# EAGLE design TinySmps (EAGLE 7.5.0)
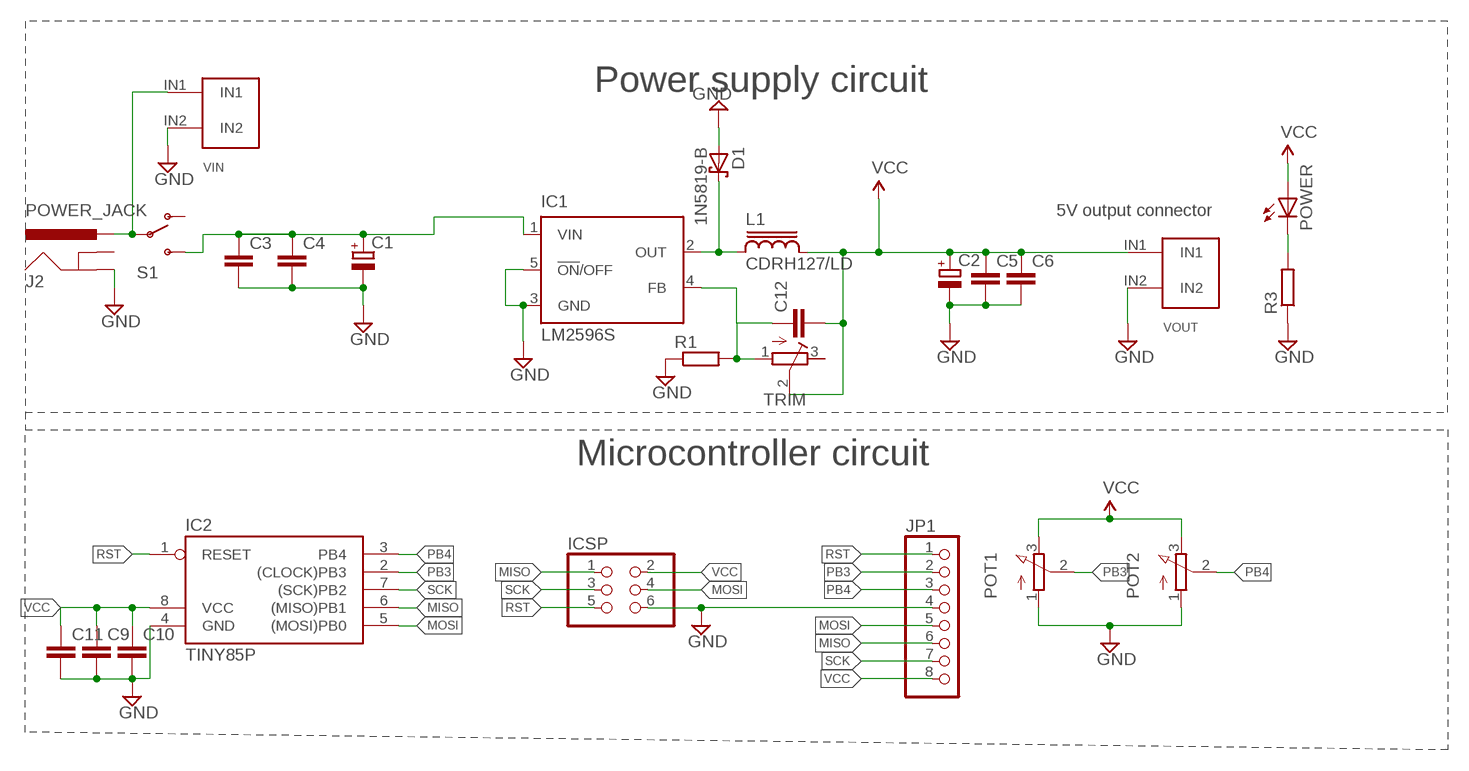
[diagram p0: schematic, sheet 1]

## Parts
C1  CPOL-EUE7.5-16  [E7,5-16]
C2  CPOL-EUE5-10.5  [E5-10,5]
C3  C-EUC1206  [C1206]
C4  C-EUC1206  [C1206]
C5  C-EUC1206  [C1206]
C6  C-EUC1206  [C1206]
C9  C-EUC1206  [C1206]
C10  C-EUC1206  [C1206]
C11  C-EUC1206  [C1206]
C12  C2,5-3  [C2.5-3]
D1  1N5819-B  [DO41-7.6]
IC1  LM2596S  [TO263-5]
IC2  TINY85P  TINY22P  [DIL08]
ICSP  PINHD-2X3  [2X03]
J2  POWER_JACK  [POWER_JACK_PTH]
JP1  PINHD-1X8  [1X08]
L1  CDRH127/LD  [CDRH127/LD]
POT1  3RP/1610N  [3RP/1610N]
POT2  3RP/1610N  [3RP/1610N]
POWER  LEDSML0805  [SML0805]
R1  R-EU_0204/7  [0204/7]
R3  R-EU_R1206  [R1206]
S1  SWITCH-SPDTKIT  [SWITCH-SPDT_KIT]
TRIM  R-TRIMM3296W  [RTRIM3296W]
VIN  1X2_5MM  [1X2_5MM]
VOUT  1X2_5MM  [1X2_5MM]

## Nets
GND: C1.- C2.- C3.2 C4.2 C5.2 C6.2 C9.2 C10.2 C11.2 D1.A IC1.3(GND) IC1.5(!ON!/OFF) IC2.4(GND) ICSP.6 J2.GND JP1.4 POT1.1(A) POT2.1(A) R1.1 R3.1 VIN.IN2 VOUT.IN2
IN: C1.+ C3.1 C4.1 IC1.1(VIN) S1.3(S)
MISO: IC2.6((MISO)PB1) ICSP.1 JP1.6
MOSI: IC2.5((MOSI)PB0) ICSP.4 JP1.5
N$1: POWER.C R3.2
N$2: D1.C IC1.2(OUT) L1.1
N$3: C12.1 IC1.4(FB) R1.2 TRIM.1(A)
N$4: J2.PWR S1.2(P) VIN.IN1
PB3: IC2.2((CLOCK)PB3) JP1.2 POT1.2(S)
PB4: IC2.3(PB4) JP1.3 POT2.2(S)
RST: IC2.1(RESET) ICSP.5 JP1.1
SCK: IC2.7((SCK)PB2) ICSP.3 JP1.7
VCC: C2.+ C5.1 C6.1 C9.1 C10.1 C11.1 C12.2 IC2.8(VCC) ICSP.2 JP1.8 L1.2 POT1.3(E) POT2.3(E) POWER.A TRIM.2(S) VOUT.IN1
Unconnected: J2.GNDBREAK S1.1(O) TRIM.3(E)

## Notes on the sheet
- Power supply circuit
- 5V output connector
- Microcontroller circuit

## Library data of the parts
C1 C2 = resistor:CPOL-EU: POLARIZED CAPACITOR, European symbol
C3-C6 C9-C11 = rcl:C-EU: CAPACITOR, European symbol
C12 = capacitor-wima:C: CAPACITOR naming: grid - package width
D1 = diode:1N581*: 1.0A SCHOTTKY BARRIER RECTIFIER Source: http://www.diodes.com/datasheets/ds23001.pdf
IC1 = national-semiconductor:LM2596: SIMPLE SWITCHER® Power Converter 150 kHz 3A Step-Down Voltage Regulator Source: http://www.national.com/ds/LM/LM2596.pdf; MF: NATIONAL SEMICONDUCTOR; MPN: LM2596S-ADJ/NOPB; OC_FARNELL: 9494367; OC_NEWARK: 41K3842
IC2 = atmel:TINY22: MICROCONTROLLER 1K ROM 128 bytes RAM 128 bytes EEPROM; OC_FARNELL: unknown; OC_NEWARK: unknown
ICSP = pinhead:PINHD-2X3: PIN HEADER
J2 = SparkFun-Connectors:POWER_JACK: Power Jack Connector This is the standard 5.5mm barrel jack for power. The PTH is the most common, proven, reliable, footprint. The Slot footprint only works if the mill layer is transmitted to the PCB fab house so be warned. Here are the connectors we sell at SparkFun: DC Barrel Power Jack/Connector <https://www.sparkfun.com/products/119> (PRT-00119) DC Barrel Power Jack/Connector (SMD) <https://www.sparkfun.com/products/12748> (PRT-12748) DC Barrel Jack Adapter - Breadboard Compatible <https://www.sparkfun.com/products/10811> (PRT-10811) It is used on this SparkFun product (and many, many others): SparkFun RedBoard - Programmed with Arduino <https://www.sparkfun.com/products/12757> (DEV-12757) Also, if you need a mating power supply or connector, please check these out: Wall Adapter Power Supply - 9VDC 650mA <https://www.sparkfun.com/products/298> (TOL-00298) DC Barrel Jack Adapter - Male <https://www.sparkfun.com/products/10287> (PRT-10287); PROD_ID: CONN-08197
JP1 = pinhead:PINHD-1X8: PIN HEADER
L1 = inductor-sumida:CDRH127/LD: Power Inductor
POT1 POT2 = pot:3RP/1610N: 16mm Potentiometer one level Source: http://www.alphapotentiometers.net/html/16mm_pot_2.html
POWER = led:LED: LED OSRAM: - CHIPLED LG R971, LG N971, LY N971, LG Q971, LY Q971, LO R971, LY R971 LH N974, LH R974 LS Q976, LO Q976, LY Q976 LO Q996 - Hyper CHIPLED LW Q18S LB Q993, LB Q99A, LB R99A - SideLED LS A670, LO A670, LY A670, LG A670, LP A670 LB A673, LV A673, LT A673, LW A673 LH A674 LY A675 LS A676, LA A676, LO A676, LY A676, LW A676 LS A679, LY A679, LG A679 - Hyper Micro SIDELED® LS Y876, LA Y876, LO Y876, LY Y876 LT Y87S - SmartLED LW L88C, LW L88S LB L89C, LB L89S, LG L890 LS L89K, LO L89K, LY L89K LS L896, LA L896, LO L896, LY L896 - TOPLED LS T670, LO T670, LY T670, LG T670, LP T670 LSG T670, LSP T670, LSY T670, LOP T670, LYG T670 LG T671, LOG T671, LSG T671 LB T673, LV T673, LT T673, LW T673 LH T674 LS T676, LA T676, LO T676, LY T676, LB T676, LH T676, LSB T676, LW T676 LB T67C, LV T67C, LT T67C, LS T67K, LO T67K, LY T67K, LW E67C LS E67B, LA E67B, LO E67B, LY E67B, LB E67C, LV E67C, LT E67C LW T67C LS T679, LY T679, LG T679 LS T770, LO T770, LY T770, LG T770, LP T770 LB T773, LV T773, LT T773, LW T773 LH T774 LS E675, LA E675, LY E675, LS T675 LS T776, LA T776, LO T776, LY T776, LB T776 LHGB T686 LT T68C, LB T68C - Hyper Mini TOPLED® LB M676 - Mini TOPLED Santana® LG M470 LS M47K, LO M47K, LY M47K Source: http://www.osram.convergy.de LUXEON: - LUMILED® LXK2-PW12-R00, LXK2-PW12-S00, LXK2-PW14-U00, LXK2-PW14-V00 LXK2-PM12-R00, LXK2-PM12-S00, LXK2-PM14-U00 LXK2-PE12-Q00, LXK2-PE12-R00, LXK2-PE12-S00, LXK2-PE14-T00, LXK2-PE14-U00 LXK2-PB12-K00, LXK2-PB12-L00, LXK2-PB12-M00, LXK2-PB14-N00, LXK2-PB14-P00, LXK2-PB14-Q00 LXK2-PR12-L00, LXK2-PR12-M00, LXK2-PR14-Q00, LXK2-PR14-R00 LXK2-PD12-Q00, LXK2-PD12-R00, LXK2-PD12-S00 LXK2-PH12-R00, LXK2-PH12-S00 LXK2-PL12-P00, LXK2-PL12-Q00, LXK2-PL12-R00 Source: www.luxeon.com KINGBRIGHT: KA-3528ASYC Source: www.kingbright.com
R1 = rcl:R-EU_: RESISTOR, European symbol
R3 = resistor:R-EU_: RESISTOR, European symbol
S1 = SparkFun-Electromechanical:SWITCH-SPDT: SPDT Switch Simple slide switch, Spark Fun Electronics SKU : COM-00102 DPDT SMT slide switch, AYZ0202, SWCH-08179; PROD_ID: SWCH-08261
TRIM = resistor:R-TRIMM: Trimm resistor
VIN VOUT = doru_terminal_block:1X2_5MM

## Board
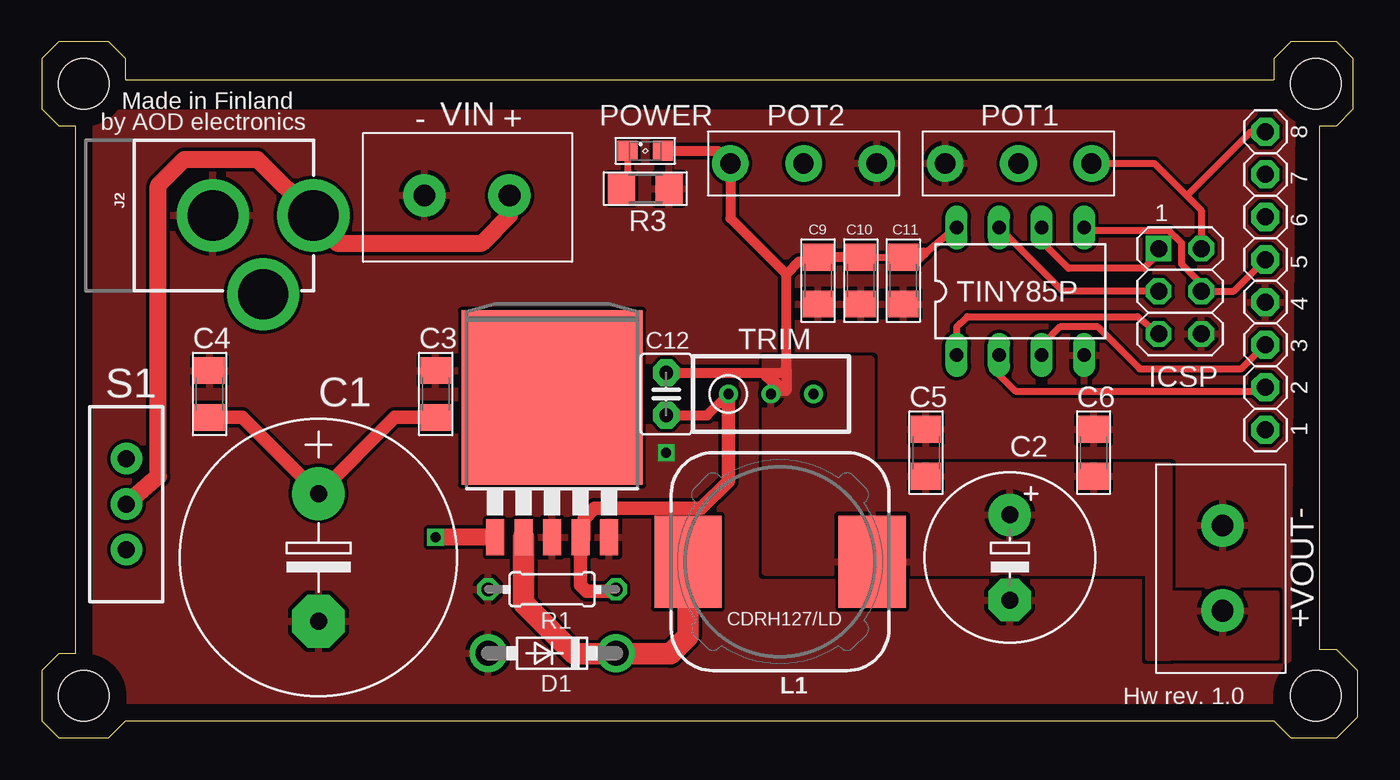
[diagram p1: board, top side]
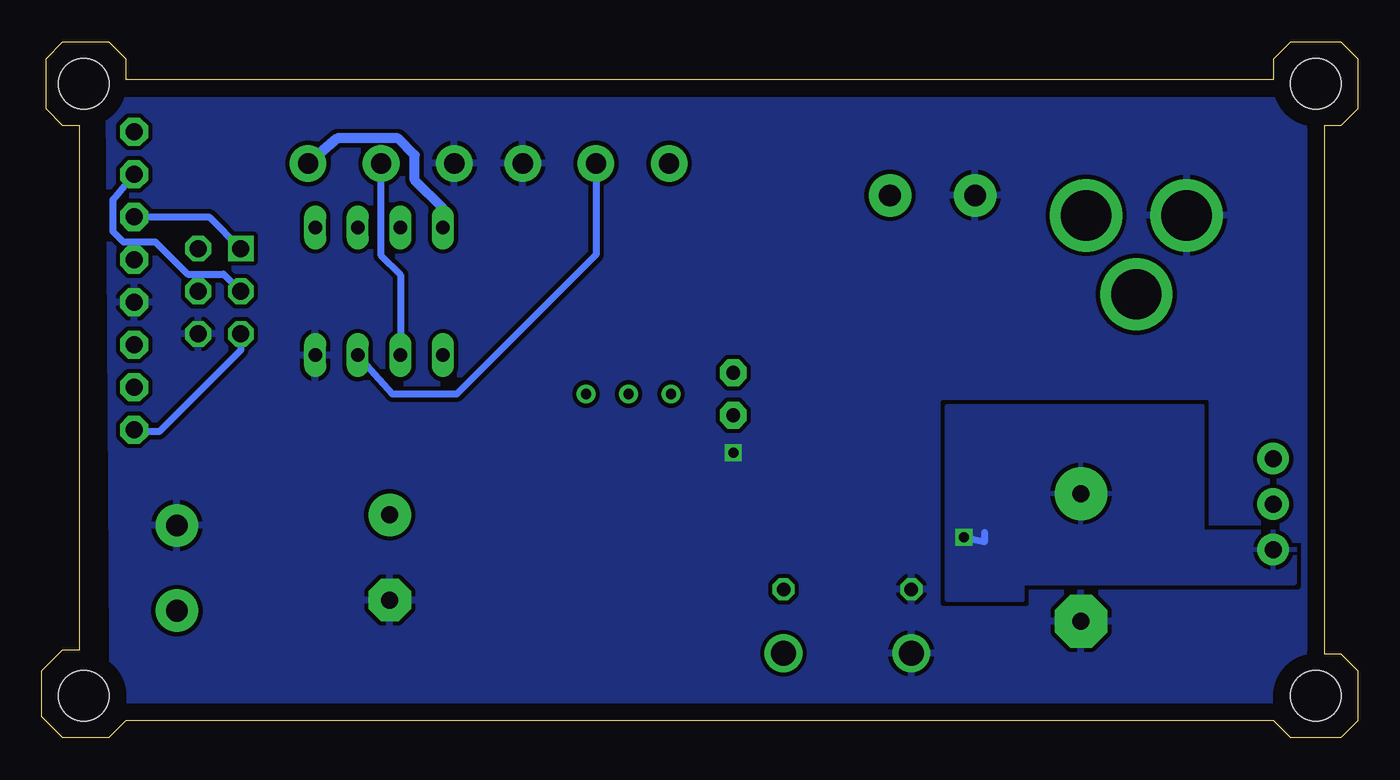
[diagram p2: board, bottom side, seen from below]

Size 78.5 x 41.5 mm. Coordinates in mm from the lower left corner, seen from the top.
Outline: 5,39.25 5,40.5 4,41.5 1,41.5 0,40.5 0,37.5 1,36.5 2,36.5 2,5 1,5 0,4 0,1 1,0 4,0 5,1 73.5,1 74.5,0 77.25,0 78.5,1.25 78.5,4 77.25,5.25 76.25,5.25 76.25,36.5 77.25,36.5 78.25,37.5 78.25,40.5 77.25,41.5 74.5,41.5 73.5,40.5 73.5,39.25 5,39.25
Copper layers (1*16): Top 0.035mm / dielectric 1.5mm / Bottom 0.035mm
Design rules "default *": minimum track width 10mil, minimum drill 24mil, track to track 8mil, track to pad 8mil, pad to pad 8mil, via to via 8mil, smd to smd 8mil, copper to edge 40mil, drill to drill 8mil, minimum pad ring 10mil, minimum via ring 8mil, stop-mask expansion 4mil, vias tented up to drill 0mil, thermal gap 10mil
Holes 3 mm at 2.5,39 76,39 76,2.5 2.5,2.5

### Footprints (pad centres in the part's own frame; a part is rotated, then mirrored left to right if it is on the bottom)
E7,5-16 = drill 1.016 pad 3.15: + -3.81,0 | drill 1.016 pad 3.15 octagon: - 3.81,0
E5-10,5 = drill 1.016 pad 2.54: + -2.54,0 | drill 1.016 pad 2.54 octagon: - 2.54,0
C1206 = smd 1.6 x 1.8: 1 -1.4,0; 2 1.4,0
C2.5-3 = drill 0.813 pad 1.6 octagon: 1 -1.27,0; 2 1.27,0
DO41-7.6 = drill 1.5 pad 2.184: A 3.81,0; C -3.81,0
TO263-5 = smd 1.067 x 2.159: 1 -3.404,-5.791; 2 -1.702,-5.791; 3 0,-5.791; 4 1.702,-5.791; 5 3.404,-5.791 | smd 10.8 x 10.41: 6 0,2.54
DIL08 = drill 0.813 long: 1 -3.81,-3.81; 2 -1.27,-3.81; 3 1.27,-3.81; 4 3.81,-3.81; 5 3.81,3.81; 6 1.27,3.81; 7 -1.27,3.81; 8 -3.81,3.81
2X03 = drill 1.016 square: 1 -2.54,-1.27 | drill 1.016 octagon: 2 -2.54,1.27; 3 0,-1.27; 4 0,1.27; 5 2.54,-1.27; 6 2.54,1.27
POWER_JACK_PTH = drill 2.997 pad 4.318: GND 0,7.7; GNDBREAK 4.7,10.7; PWR 0,13.7
1X08 = drill 1.016 pad 1.676 octagon: 1 -8.89,0; 2 -6.35,0; 3 -3.81,0; 4 -1.27,0; 5 1.27,0; 6 3.81,0; 7 6.35,0; 8 8.89,0
CDRH127/LD = smd 4 x 5.5: 1 -5.5,0; 2 5.5,0
3RP/1610N = drill 1.2 pad 2.184: 1 -4.365,0; 2 0,0; 3 4.365,0
SML0805 = smd 1.2 x 1.2: A 1.05,0; C -1.05,0
0204/7 = drill 0.813 octagon: 1 -3.81,0; 2 3.81,0
R1206 = smd 1.6 x 1.803: 1 -1.422,0; 2 1.422,0
SWITCH-SPDT_KIT = drill 1.016 pad 1.88: 1 0,2.718; 2 0,0; 3 0,-2.718
RTRIM3296W = drill 0.61: 1 0,-2.54; 2 0,0; 3 0,2.54
1X2_5MM = drill 1.3 pad 2.54: IN1 0,0; IN2 5.08,0

### Placement (x,y rotation side)
C1  16.5,10.75 270 top
C2  57.75,10.75 270 top
C3  23.5,20.5 90 top
C4  10,20.5 90 top
C5  52.75,17 90 top
C6  62.75,17 90 top
C9  46.31,27.27 270 top
C10  48.85,27.27 270 top
C11  51.4,27.27 270 top
C12  37.25,20.5 90 top
D1  30.44,5.04 180 top
IC1  30.44,17.74 0 top
IC2  58.38,26.63 0 top
ICSP  67.91,26.63 270 top
J2  2.5,31.15 270 top
JP1  73,27.25 90 top
L1  44.04,10.5 0 top
POT1  58.26,34.25 0 top
POT2  45.45,34.25 180 top
POWER  36,35 0 top
R1  30.44,8.85 0 top
R3  36,32.75 180 top
S1  5.04,13.93 0 top
TRIM  43.5,20.5 270 top
VIN  27.9,32.34 180 top
VOUT  70.44,7.58 90 top

### Tracks (layer width: path | path; a pad name or v marks a point on that pad's centre or on a via)
GND  (via drill 0.6)
  other vias: 37.25,17
  pour Top (rank 6): 2.5,37.27 74.56,37.27 74.31,0.75 2.5,0.75
  pour Bottom (isolate 0.254, rank 6): 2.5,38.1 74.53,38.1 74.28,0.75 2.5,0.75
IN  (via drill 0.6)
  Top 0.813: C4.1 11.96,19.1 C1.+ 21.04,19.1 C3.1
  Top 1.016: IC1.1 v23.5,11.95
  Bottom 0.406: v23.5,11.95 22.25,11.7 22.25,12.25
  pour Bottom: 3.75,12.25 9.25,12.25 9.25,19.75 24.5,19.75 24.5,8.25 20,8.25 20,9.25 3.75,9.25
MISO
  Top 0.406: ICSP.1 66.64,28.89 65.75,28 61.25,28 59.75,29.5 59.75,30.09 IC2.6
  Bottom 0.406: JP1.6 68.53,31.06 ICSP.1
MOSI
  Top 0.406: IC2.5 62.25,30.25 67.25,30.25 68,29.5 68,28.25 69.17,27.07 ICSP.4 71.11,26.63 JP1.5
N$1
  Top 0.406: POWER.C 34.95,32.87 R3.2
N$2
  Top 1.27: IC1.2 28.74,8.01 31.75,5 34.21,5 D1.C 34.29,5 37.5,5 38.54,6.04 L1.1
  Top 1.422: 39.33,8.6 39.33,9.46 L1.1
N$3
  Top 0.61: C12.1 39.69,19.23 TRIM.1
  Top 0.813: TRIM.1 40.96,15.31 39.33,13.68 32.98,13.68 32.34,13.04 32.34,11.9 IC1.4 32.14,9.11 32.5,8.75 34.15,8.75 R1.2
N$4
  Top 1.016: S1.2 6.95,15.59 6.95,32.95 8.5,34.5 12,34.5 | VIN.IN1 27.9,31.15 26.25,29.5 17.6,29.5 16.2,30.9 J2.PWR 12.85,34.5 12,34.5 | 12,34.5 12.6,34.5
PB3
  Top 0.406: IC2.2 57.11,21.64 58.09,20.66 72.77,20.66 JP1.2
  Bottom 0.406: IC2.2 57.11,27.61 58.25,28.75 58.25,33.99 POT1.2
PB4
  Top 0.406: IC2.3 59.75,22.67 59.75,23.5 60.75,24.5 63,24.5 65.5,22 71.56,22 JP1.3
  Bottom 0.406: POT2.2 45.45,28.8 53.75,20.5 57.58,20.5 IC2.3
RST
  Top 0.406: IC2.1 54.57,24.48 55.2,25.11 65.36,25.11 ICSP.5
  Bottom 0.406: ICSP.5 66.64,23.11 71.5,18.25 72.89,18.25 JP1.1
SCK
  Top 0.406: ICSP.3 60.92,26.63 IC2.7
  Bottom 0.406: JP1.7 74.25,32.09 74.25,30.19 73.62,29.55 71.72,29.55 69.81,27.65 67.66,27.65 ICSP.3
VCC
  Top 0.406: ICSP.2 69.17,31.46 68.32,32.32 | C10.1 C11.1 52.16,28.41 IC2.8 | POT1.3 66.39,34.25 68.32,32.32 | JP1.8 72.14,36.14 68.32,32.32
  Top 0.61: 44.41,27.65 45.17,28.41 45.55,28.41 45.68,28.29 46.19,28.29 C9.1 C10.1 | 44.41,22 44.41,27.65 | 44.41,22 44.41,20.66 43.91,20.66 | 43.91,20.66 TRIM.2 | 52.16,28.41 52.66,28.92 52.53,28.92 C11.1 | 43.23,21.52 43.5,21.25 43.75,21.25 43.91,21.09 43.91,20.66 | 44.41,27.65 41.08,30.98 POT2.3 40.33,35 POWER.A | C12.2 44.18,21.77 44.41,22
  Bottom 0.61: IC2.8 54.57,31.57 56.25,33.25 56.25,34.75 57.25,35.75 60.88,35.75 POT1.3
  pour Top (isolate 0.254): 43.14,9.87 66,9.87 66,4.79 67.27,4.79 67.27,16.22 49.49,16.22 49.49,22.57 43.14,22.57
  pour Top (isolate 0.254): 67.27,8.6 73.62,8.6 73.62,4.79 67.27,4.79

### Text on the board
tPlace: Made in Finland | by AOD electronics | 8 | 7 | 1 | 6 | 5 | 4 | 3 | 2 | 1 | Hw rev. 1.0
tNames: - | + | - | +